# Altium schematic sheet STM32405RG.SchDoc: MCU STM
size A4; Author: Jennifer, Gaston, Alfonso; Organization: Waterloop; Address1: 200 University Ave W; Address2: Engineering 5, 1104; Address3: Waterloo, ON; Address4: N2L 3G1; DocumentNumber: 3; SheetNumber: 3; SheetTotal: 5
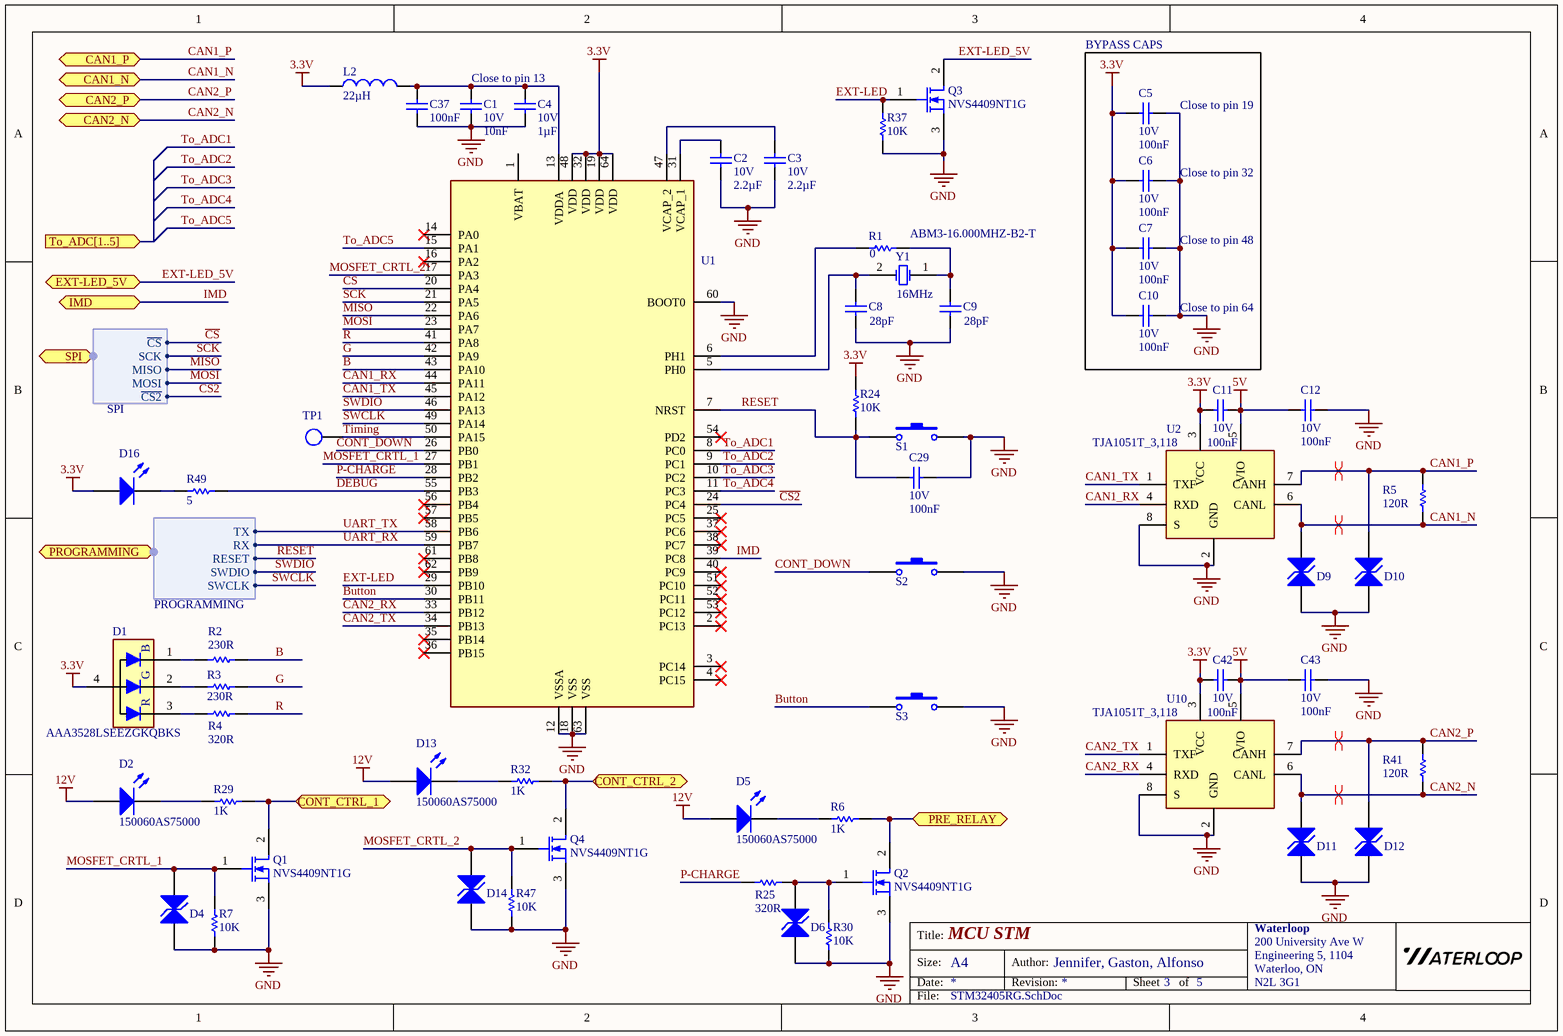
[diagram p0: STM32405RG.SchDoc]

## Parts
C1  10V  value 10nF  [0805 - Capacitor]
C2  10V  value 2.2µF  [0805 - Capacitor]
C3  10V  value 2.2µF  [0805 - Capacitor]
C4  10V  value 1µF  [0805 - Capacitor]
C5  10V  value 100nF  [0805 - Capacitor]
C6  10V  value 100nF  [0805 - Capacitor]
C7  10V  value 100nF  [0805 - Capacitor]
C8  value 28pF  [0805 - Capacitor]  (hidden comment: 50V)
C9  value 28pF  [0805 - Capacitor]  (hidden comment: 50V)
C10  10V  value 100nF  [0805 - Capacitor]
C11  10V  value 100nF  [0805 - Capacitor]
C12  10V  value 100nF  [0805 - Capacitor]
C29  10V  value 100nF  [0805 - Capacitor]
C37  value 100nF  [0805 - Capacitor]  (hidden comment: Capacitor - Nonpolarized)
C42  10V  value 100nF  [0805 - Capacitor]
C43  10V  value 100nF  [0805 - Capacitor]
D1  AAA3528LSEEZGKQBKS  [4-PLCC RGB LED]
D2  150060AS75000  [0603 - Resistor]
D4  TVS  [SOD123 - DIODE]  (value not drawn)
D5  150060AS75000  [0603 - Resistor]
D6  TVS  [SOD123 - DIODE]  (value not drawn)
D9  TVS  [SOD123 - DIODE]  (value not drawn)
D10  TVS  [SOD123 - DIODE]  (value not drawn)
D11  TVS  [SOD123 - DIODE]  (value not drawn)
D12  TVS  [SOD123 - DIODE]  (value not drawn)
D13  150060AS75000  [0603 - Resistor]
D14  TVS  [SOD123 - DIODE]  (value not drawn)
D16  LED  [0805 - Resistor]  (value not drawn)
L2  value 22µH  [0805 - Capacitor]  (hidden comment: Inductor)
Q1  NVS4409NT1G  [SC70/SOT323]
Q2  NVS4409NT1G  [SC70/SOT323]
Q3  NVS4409NT1G  [SC70/SOT323]
Q4  NVS4409NT1G  [SC70/SOT323]
R1  value 0  [0603 - Resistor]  (hidden comment: 0603)
R2  value 230R  [0603 - Resistor]  (hidden comment: 1%)
R3  value 230R  [0603 - Resistor]  (hidden comment: 1%)
R4  value 320R  [0603 - Resistor]  (hidden comment: 1%)
R5  value 120R  [0603 - Resistor]  (hidden comment: 1%)
R6  value 1K  [0603 - Resistor]  (hidden comment: 5%)
R7  value 10K  [0603 - Resistor]  (hidden comment: 5%)
R24  value 10K  [0603 - Resistor]  (hidden comment: 5%)
R25  value 320R  [0603 - Resistor]  (hidden comment: 1%)
R29  value 1K  [0603 - Resistor]  (hidden comment: 5%)
R30  value 10K  [0603 - Resistor]  (hidden comment: 5%)
R32  value 1K  [0603 - Resistor]  (hidden comment: 5%)
R37  value 10K  [0603 - Resistor]  (hidden comment: 5%)
R41  value 120R  [0603 - Resistor]  (hidden comment: 1%)
R47  value 10K  [0603 - Resistor]  (hidden comment: 5%)
R49  value 5  [0603 - Resistor]  (hidden comment: Resistor)
S1  PTS636 SM43 SMTR LFS  [6x6mm Switch]  (value not drawn)
S2  PTS636 SM43 SMTR LFS  [6x6mm Switch]  (value not drawn)
S3  PTS636 SM43 SMTR LFS  [6x6mm Switch]  (value not drawn)
TP1  (no value)  [Test Point - 5002]  (no BOM)
U1  (no value)  [STM32F405RGT6TR]
U2  TJA1051T_3,118  [TJA1051T/3,118]
U10  TJA1051T_3,118  [TJA1051T/3,118]
Y1  ABM3-16.000MHZ-B2-T  value 16MHz  [2-SMD NO LEAD CRSYSTAL]

## Ports
CAN1_N (bidir), CAN1_P (bidir), CAN2_N (bidir), CAN2_P (bidir), CONT_CTRL_1 (bidir), CONT_CTRL_2 (bidir), EXT-LED_5V (bidir), IMD (bidir), PRE_RELAY (bidir), PROGRAMMING (bidir, harness PROGRAMMING), SPI (bidir, harness SPI), To_ADC[1..5] (in)

## Harnesses
SPI: ~{CS}, SCK, MISO, MOSI, ~{CS2}
PROGRAMMING: SWCLK, SWDIO, RESET, TX, RX

## Nets
3.3V: C5.1 C6.1 C7.1 C10.1 C11.2 C42.2 D1.4 D16.1(A) L2.1 R24.2 U1.19(VDD) U1.32(VDD) U1.48(VDD) U1.64(VDD) U2.3(VCC) U10.3(VCC)
5V: C11.1 C12.1 C42.1 C43.1 U2.5(VIO) U10.5(VIO)
12V: D2.1(A) D5.1(A) D13.1(A)
GND: C1.1 C2.1 C3.1 C4.2 C5.2 C6.2 C7.2 C8.1 C9.1 C10.2 C12.2 C29.2 C37.1 C43.2 D4.1(A) D6.1(A) D9.1(A) D10.1(A) D11.1(A) D12.1(A) D14.1(A) Q1.3(S) Q2.3(S) Q3.3(S) Q4.3(S) R7.1 R30.1 R37.1 R47.1 S1.2 S2.2 S3.2 U1.12(VSSA) U1.18(VSS) U1.60(BOOT0) U1.63(VSS) U2.2(GND) U2.8(S) U10.2(GND) U10.8(S)
B: R2.1 U1.43(PA10)
Button: S3.1 U1.30(PB11)
~{CS}: U1.20(PA4) ; port SPI.~{CS}
~{CS2}: U1.24(PC4) ; port SPI.~{CS2}
CAN1_N: D9.2(K) R5.1 U2.6(CANL) ; port CAN1_N
CAN1_P: D10.2(K) R5.2 U2.7(CANH) ; port CAN1_P
CAN1_RX: U1.44(PA11) U2.4(RXD)
CAN1_TX: U1.45(PA12) U2.1(TXF)
CAN2_N: D11.2(K) R41.1 U10.6(CANL) ; port CAN2_N
CAN2_P: D12.2(K) R41.2 U10.7(CANH) ; port CAN2_P
CAN2_RX: U1.33(PB12) U10.4(RXD)
CAN2_TX: U1.34(PB13) U10.1(TXF)
CONT_CTRL_1: Q1.2(D) R29.1 ; port CONT_CTRL_1
CONT_CTRL_2: Q4.2(D) R32.1 ; port CONT_CTRL_2
CONT_DOWN: S2.1 U1.26(PB0)
DEBUG: R49.2 U1.55(PB3)
EXT-LED: Q3.1(G) R37.2 U1.29(PB10)
EXT-LED_5V: Q3.2(D) ; port EXT-LED_5V
G: R3.1 U1.42(PA9)
IMD: U1.39(PC8) ; port IMD
MISO: U1.22(PA6) ; port SPI.MISO
MOSFET_CRTL_1: D4.2(K) Q1.1(G) R7.2 U1.27(PB1)
MOSFET_CRTL_2: D14.2(K) Q4.1(G) R47.2 U1.17(PA3)
MOSI: U1.23(PA7) ; port SPI.MOSI
P-CHARGE: R25.2 U1.28(PB2)
PRE_RELAY: Q2.2(D) R6.1 ; port PRE_RELAY
R: R4.1 U1.41(PA8)
RESET: C29.1 R24.1 S1.1 U1.7(NRST) ; port PROGRAMMING.RESET
SCK: U1.21(PA5) ; port SPI.SCK
SWCLK: U1.49(PA14) ; port PROGRAMMING.SWCLK
SWDIO: U1.46(PA13) ; port PROGRAMMING.SWDIO
Timing: TP1.1 U1.50(PA15)
To_ADC1: U1.8(PC0)
To_ADC2: U1.9(PC1)
To_ADC3: U1.10(PC2)
To_ADC4: U1.11(PC3)
To_ADC5: U1.15(PA1)
UART_RX: U1.59(PB7) ; port PROGRAMMING.RX
UART_TX: U1.58(PB6) ; port PROGRAMMING.TX
NetC1_2: C1.2 C4.1 C37.2 L2.2 U1.13(VDDA)
NetC2_2: C2.2 U1.31(VCAP_1)
NetC3_2: C3.2 U1.47(VCAP_2)
NetC8_2: C8.2 U1.5(PH0) Y1.2(OSC2)
NetC9_2: C9.2 R1.2 Y1.1(OSC1)
NetD1_1: D1.1 R2.2
NetD1_2: D1.2 R3.2
NetD1_3: D1.3 R4.2
NetD2_2: D2.2(K) R29.2
NetD5_2: D5.2(K) R6.2
NetD6_2: D6.2(K) Q2.1(G) R25.1 R30.2
NetD13_2: D13.2(K) R32.2
NetD16_2: D16.2(K) R49.1
NetR1_1: R1.1 U1.6(PH1)

Not connected (* = marked no-connect by the designer): U1 1(VBAT) 2(PC13)* 3(PC14)* 4(PC15)* 14(PA0)* 16(PA2)* 25(PC5)* 35(PB14)* 36(PB15)* 37(PC6)* 38(PC7)* 40(PC9)* 51(PC10)* 52(PC11)* 53(PC12)* 54(PD2)* 56(PB4)* 57(PB5)* 61(PB8)* 62(PB9)*

## Layout directives
differential pair: CAN1_N, CAN1_P, CAN2_N, CAN2_P

## Notes on the sheet
- Close to pin 13
- BYPASS CAPS
- (near C5) Close to pin 19
- (near C6) Close to pin 32
- (near C7) Close to pin 48
- (near C10) Close to pin 64
- Title:
- Size:
- Date:
- A4
- Author:
- Revision:
- Sheet
- of
- File:
- (in symbol RGB LED- Common Anode) B; G; R

## Library data of the parts
C1 = Capacitor - Nonpolarized: C0805C103K8RAC7800. 10000pF ±10% 10V Ceramic Capacitor X7R 0805 (2012 Metric); Supplier Part Number: *; Supplier: *; Manufacturer: *; Rating: *; Manufacturer Part Number: *
C2 C3 = Capacitor - Nonpolarized: CC0805KKX7R9BB225. 2.2µF ±10% 50V Ceramic Capacitor X7R 0805 (2012 Metric); Supplier Part Number: *; Supplier: *; Manufacturer: *; Rating: *; Manufacturer Part Number: *
C4 = Capacitor - Nonpolarized: CL21B105KPFNNNE. 1µF ±10% 10V Ceramic Capacitor X7R 0805 (2012 Metric); Supplier Part Number: *; Supplier: *; Manufacturer: *; Rating: *; Manufacturer Part Number: *
C5-C7 C10-C12 C29 C37 C42 C43 = Capacitor - Nonpolarized: C0805C104K8RACTU. 0.1µF ±10% 10V Ceramic Capacitor X7R 0805 (2012 Metric); Supplier Part Number: *; Supplier: *; Manufacturer: *; Rating: *; Manufacturer Part Number: *
C8 C9 = Capacitor - Nonpolarized: CBR08C409B5GAC. 4pF ±0.1pF 50V Ceramic Capacitor C0G, NP0 0805 (2012 Metric); Supplier Part Number: *; Supplier: *; Manufacturer: *; Rating: *; Manufacturer Part Number: *
D1 = RGB LED- Common Anode: Red, Green, Blue (RGB) 621nm Red, 525nm Green, 465nm Blue LED Indication - Discrete 1.8V Red, 2.7V Green, 2.7V Blue 4-PLCC; Manufacturer Part Number: *; Manufacturer: *; Supplier Part Number: *; Supplier: *
D2 D5 D13 = LED: Amber 605nm LED Indication - Discrete 2V 0603 (1608 Metric); Value: *; Manufacturer Part Number: *; Manufacturer: *; Supplier Part Number: *; Rating: *; Supplier: *
D4 D6 D9-D12 D14 = TVS: TV02W5V0B-G, TVS DIODE 5VWM 9.2VC SOD123; Manufacturer Part Number: *; Manufacturer: *; Supplier: *; Supplier Part Number: *; Value: *
D16 = LED: 150080BS75000, LED BLUE CLEAR 0805 SMD; Value: *; Manufacturer Part Number: *; Manufacturer: *; Supplier Part Number: *; Rating: *; Supplier: *
L2 = Inductor: LBR2012T220K, 22 µH ±10% 100 mA 0805 (2012 Metric); Rating: *; Manufacturer Part Number: *; Supplier Part Number: *; Supplier: *; Manufacturer: *
Q1-Q4 = MOSFET-N: N-Channel MOSFET; Supplier: *; Manufacturer Part Number: *; Supplier Part Number: *; Rating: *; Manufacturer: *; Value: *
R1 = Resistor: ERJ-U030R00V. 0 Ohms Jumper 0.1W, 1/10W Chip Resistor 0603 (1608 Metric) Anti-Sulfur, Automotive AEC-Q200 Thick Film; Rating: *; Manufacturer Part Number: *; Manufacturer: *; Supplier Part Number: *; Supplier: *
R2-R5 R25 R41 = Resistor: RC0603FR-07120RL. 120 Ohms ±1% 0.1W, 1/10W Chip Resistor 0603 (1608 Metric) Moisture Resistant Thick Film; Rating: *; Manufacturer Part Number: *; Manufacturer: *; Supplier Part Number: *; Supplier: *
R6 R29 R32 = Resistor: ERJ-PA3J202V. 2 kOhms ±5% 0.25W, 1/4W Chip Resistor 0603 (1608 Metric) Automotive AEC-Q200, Pulse Withstanding Thick Film; Rating: *; Manufacturer Part Number: *; Manufacturer: *; Supplier Part Number: *; Supplier: *
R7 R24 R30 R37 R47 = Resistor: ERJ-3GEYJ103V. 10 kOhms ±5% 0.1W, 1/10W Chip Resistor 0603 (1608 Metric) Automotive AEC-Q200 Thick Film; Rating: *; Manufacturer Part Number: *; Manufacturer: *; Supplier Part Number: *; Supplier: *
R49 = Resistor: RC0603FR-075R1L, RES 5.1 OHM 1% 1/10W 0603; Rating: *; Manufacturer Part Number: *; Manufacturer: *; Supplier Part Number: *; Supplier: *
S1-S3 = Switch - Push Button: Tactile Switch SPST-NO Top Actuated Surface Mount; Supplier: *; Manufacturer Part Number: *; Manufacturer: *; Supplier Part Number: *; Rating: *; Value: *
TP1 = Test Point
U1 = STM32F405RGT6: ST 64-pin Micro; Manufacturer Part Number: STM32F405RG; Manufacturer: ST; Supplier Part Number: 497-11767-ND; Supplier: Digikey; ComponentLink1Description: Datsheet; ComponentLink1URL: https://www.st.com/content/ccc/resource/technical/document/datasheet/ef/92/76/6d/bb/c2/4f/f7/DM00037051.pdf/files/DM00037051.pdf/jcr:content/translations/en.DM00037051.pdf
U2 U10 = TJA1051T_3,118: CAN Transceiver IC 4.5V-5.5V 250ns; Manufacturer: NXP; Manufacturer Part Number: TJA1051T/3,118; Supplier Part Number: 568-8684-1-ND; Supplier: Digikey; ComponentLink1Description: Datasheet; ComponentLink1URL: http://www.nxp.com/docs/en/data-sheet/TJA1051.pdf
Y1 = Oscillator: 8MHz ±20ppm Crystal 12pF 300 Ohms 2-SMD, No Lead; Manufacturer Part Number: *; Manufacturer: *; Supplier Part Number: *; Supplier: *; Rating: *